# EAGLE design Display (EAGLE 9.3.0)
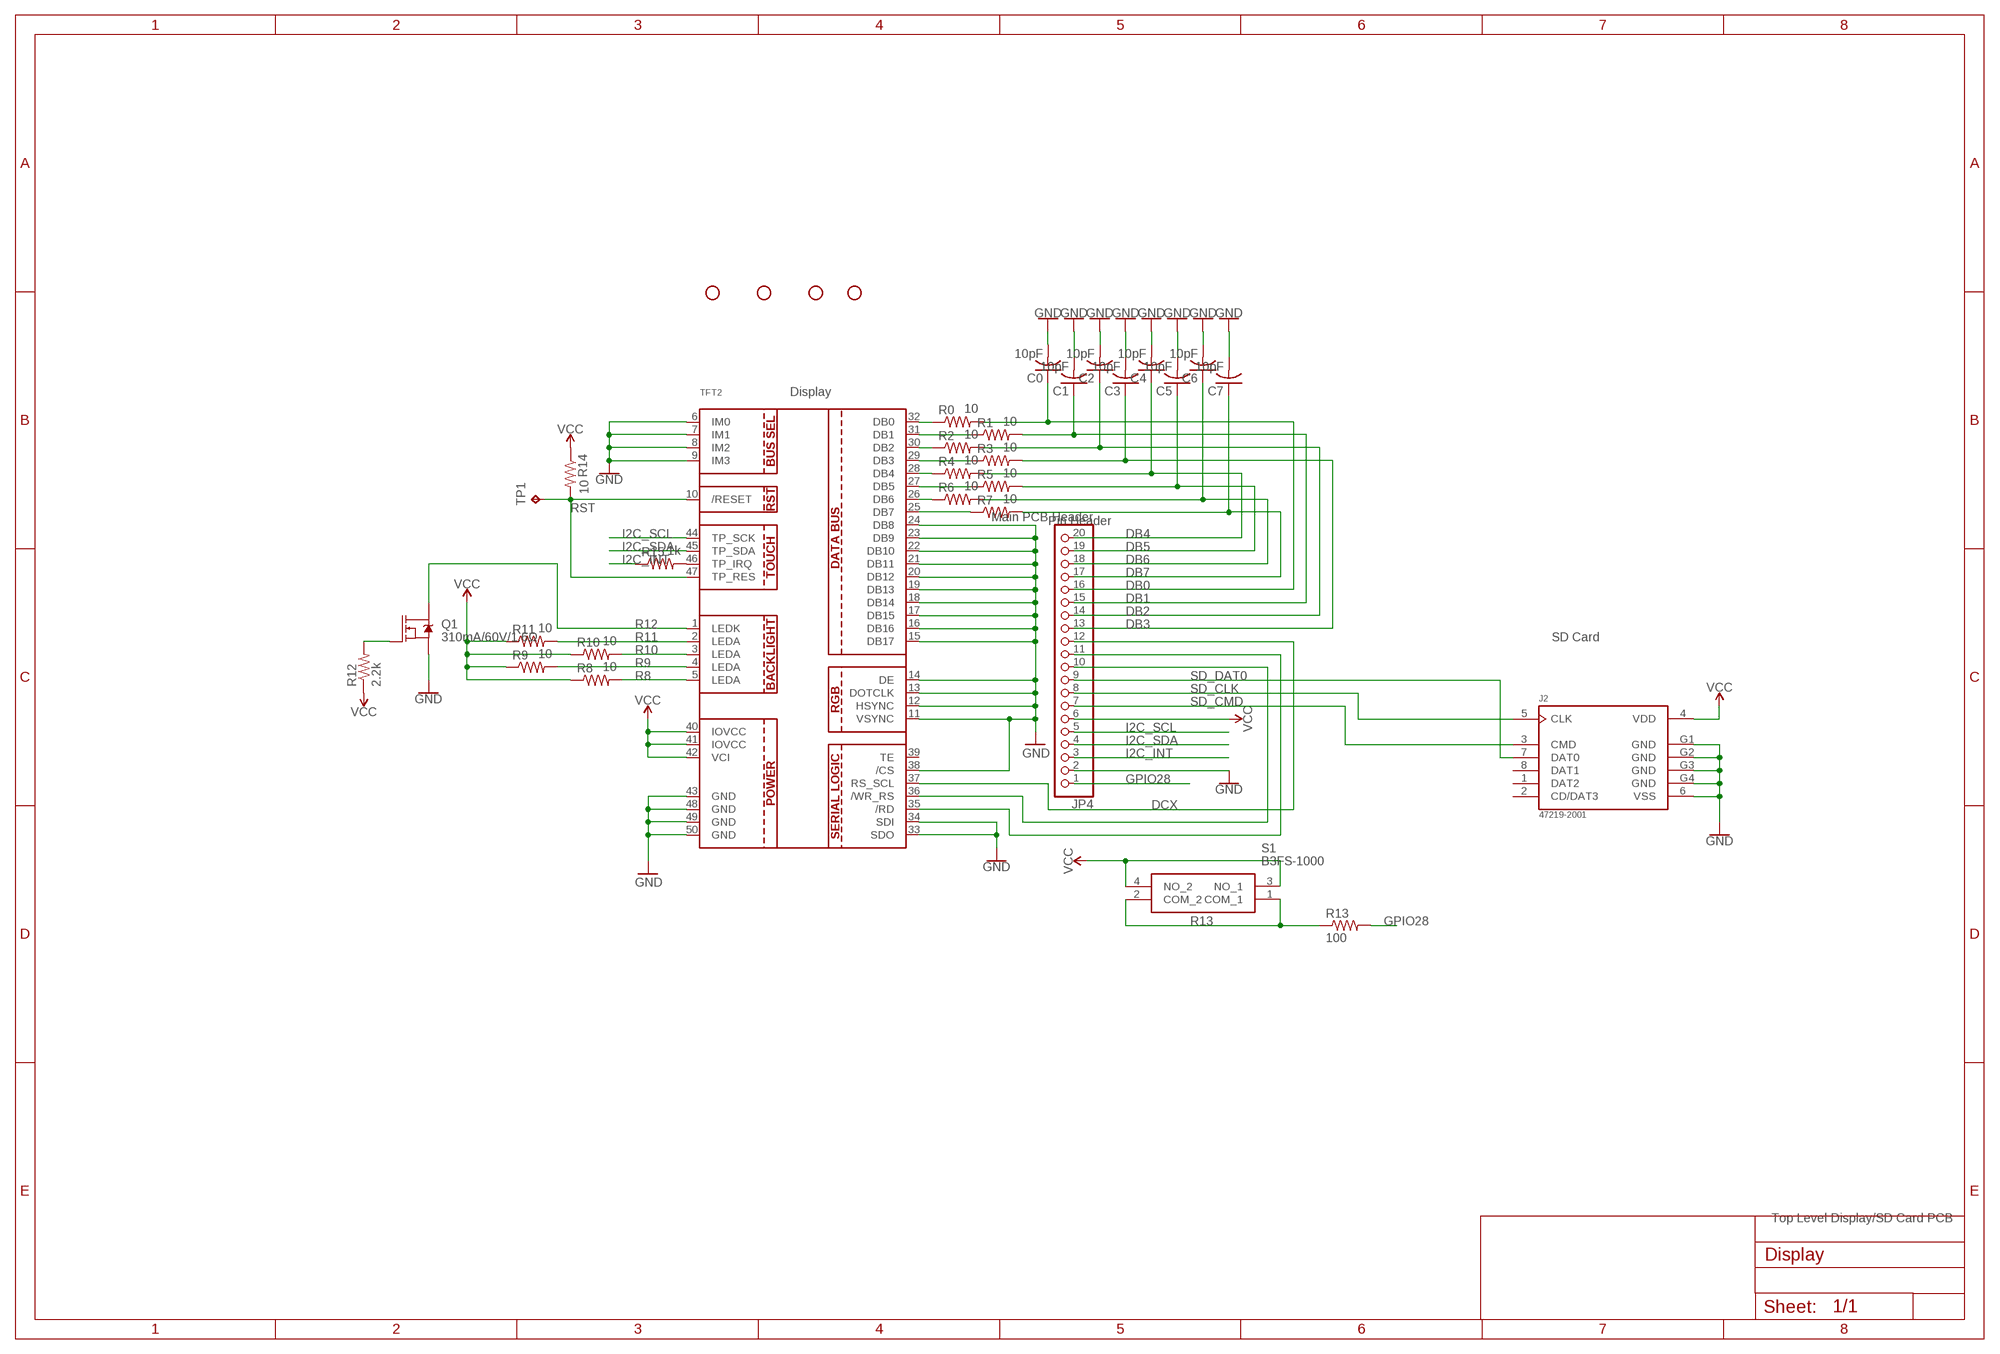
[diagram p0: schematic, sheet 1]

## Parts
C0  10pF  C-USC0805  [C0805]
C1  10pF  C-USC0805  [C0805]
C2  10pF  C-USC0805  [C0805]
C3  10pF  C-USC0805  [C0805]
C4  10pF  C-USC0805  [C0805]
C5  10pF  C-USC0805  [C0805]
C6  10pF  C-USC0805  [C0805]
C7  10pF  C-USC0805  [C0805]
H1  STAND-OFF  [STAND-OFF]
H2  STAND-OFF  [STAND-OFF]
H3  STAND-OFF  [STAND-OFF]
H4  STAND-OFF  [STAND-OFF]
J2  47219-2001  [MOLEX_47219-2001]
JP4  Main PCB Header  PINHD-1X20  [1X20]
Q1  310mA/60V/1.6Ω  MOSFET-NCH-2N7002PW  [SOT323]
R0  10  R-US_R0805  [R0805]
R1  10  R-US_R0805  [R0805]
R2  10  R-US_R0805  [R0805]
R3  10  R-US_R0805  [R0805]
R4  10  R-US_R0805  [R0805]
R5  10  R-US_R0805  [R0805]
R6  10  R-US_R0805  [R0805]
R7  10  R-US_R0805  [R0805]
R8  10  R-US_R0805  [R0805]
R9  10  R-US_R0805  [R0805]
R10  10  R-US_R0805  [R0805]
R11  10  R-US_R0805  [R0805]
R12  2.2k  R-US_M0805  [M0805]
R13  100  R-US_R0805  [R0805]
R14  10  R-US_R0805  [R0805]
R15  1k  R-US_R0805  [R0805]
S1  B3FS-1000  [B3FS1000]
TFT2  DISP_LCD_CTP28_DATASHEET  [TFT_CTP28]
TP1  TPTP09R  [TP09R]

## Nets
DB0: C0.1 JP4.16 R0.2
DB1: C1.1 JP4.15 R1.2
DB2: C2.1 JP4.14 R2.2
DB3: C3.1 JP4.13 R3.2
DB4: C4.1 JP4.20 R4.2
DB5: C5.1 JP4.19 R5.2
DB6: C6.1 JP4.18 R6.2
DB7: C7.1 JP4.17 R7.2
DCX: JP4.12 TFT2.37(RS_SCL)
GND: C0.2 C1.2 C2.2 C3.2 C4.2 C5.2 C6.2 C7.2 J2.6(VSS) J2.G1(GND) J2.G2(GND) J2.G3(GND) J2.G4(GND) JP4.2 Q1.2(S) TFT2.6(IM0) TFT2.7(IM1) TFT2.8(IM2) TFT2.9(IM3) TFT2.11(VSYNC) TFT2.12(HSYNC) TFT2.13(DOTCLK) TFT2.14(DE) TFT2.15(DB17) TFT2.16(DB16) TFT2.17(DB15) TFT2.18(DB14) TFT2.19(DB13) TFT2.20(DB12) TFT2.21(DB11) TFT2.22(DB10) TFT2.23(DB9) TFT2.24(DB8) TFT2.33(SDO) TFT2.34(SDI) TFT2.38(/CS) TFT2.43(GND) TFT2.48(GND) TFT2.49(GND) TFT2.50(GND)
GPIO28: JP4.1 R13.2
I2C_INT: JP4.3 R15.1
I2C_SCL: JP4.5 TFT2.44(TP_SCK)
I2C_SDA: JP4.4 TFT2.45(TP_SDA)
N$1: R0.1 TFT2.32(DB0)
N$2: R1.1 TFT2.31(DB1)
N$3: R2.1 TFT2.30(DB2)
N$4: R15.2 TFT2.46(TP_IRQ)
N$5: R3.1 TFT2.29(DB3)
N$6: R4.1 TFT2.28(DB4)
N$7: R5.1 TFT2.27(DB5)
N$8: R7.1 TFT2.25(DB7)
N$9: R6.1 TFT2.26(DB6)
N$76: Q1.1(G) R12.2
R8: R8.2 TFT2.5(LEDA)
R9: R9.2 TFT2.4(LEDA)
R10: R10.2 TFT2.3(LEDA)
R11: R11.2 TFT2.2(LEDA)
R12: Q1.3(D) TFT2.1(LEDK)
R13: R13.1 S1.1(COM_1) S1.2(COM_2)
RDX: JP4.11 TFT2.35(/RD)
RST: R14.2 TFT2.10(/RESET) TFT2.47(TP_RES) TP1.TP
SD_CLK: J2.5(CLK) JP4.8
SD_CMD: J2.3(CMD) JP4.7
SD_DAT0: J2.7(DAT0) JP4.9
VCC: J2.4(VDD) JP4.6 R8.1 R9.1 R10.1 R11.1 R12.1 R14.1 S1.3(NO_1) S1.4(NO_2) TFT2.40(IOVCC) TFT2.41(IOVCC) TFT2.42(VCI)
WRX: JP4.10 TFT2.36(/WR_RS)
Unconnected: J2.1(DAT2) J2.2(CD/DAT3) J2.8(DAT1) TFT2.39(TE)

## Notes on the sheet
- Display
- Pin Header
- SD Card
- Top Level Display/SD Card PCB

## Library data of the parts
C0 C1-C7 = adafruit:C-US: CAPACITOR, American symbol
H1-H4 = SparkFun-Hardware:STAND-OFF: Stand Off Drill holes for mechanically mounting via screws, standoffs, etc. Note: Use the keepout ring to avoid running the screw head into surrounding components. Variant Overviews STAND-OFF - Mechanical footprint for a #4 phillips button head screw. STAND-OFF-TIGHT - Mechanical footprint for a #4 phillips button head screw, Example SparkFun Products Screw - Phillips Head (1/4", 4-40, 10 pack) <https://www.sparkfun.com/products/10453> (PRT-10453) Screw - Phillips Head (1/2", 4-40, 10 pack) <https://www.sparkfun.com/products/10452> (PRT-10452) Screw - Phillips Head (3/4", 4-40, 10 pack) <https://www.sparkfun.com/products/10451> (PRT-10451) Screw - Phillips Head (1", 4-40, 10 pack) <https://www.sparkfun.com/products/10450> (PRT-10450)
J2 = 47219-2001:47219-2001: 1.10mm Pitch microSD Card Connector, Hinge Type, Lead-Free http://www.snapeda.com/parts/47219-2001/Molex%20/%20Waldom/view-part/#; AVAILABILITY: Unavailable; DESCRIPTION: 8 Position Card Connector Secure Digital - microSD™ Surface Mount, Right Angle Gold; MF: Molex; MP: 47219-2001; PACKAGE: None; PRICE: None
JP4 = adafruit:PINHD-1X20: PIN HEADER
Q1 = SparkFun-DiscreteSemi:MOSFET-NCH: N-channel MOSFETs Voltage controlled devices that allow control of high current outputs. SparkFun Products: SparkFun OpenScale <https://www.sparkfun.com/products/13261> SparkFun Digital Sandbox <https://www.sparkfun.com/products/12651> SparkFun Monster Moto Shield <https://www.sparkfun.com/products/10182> SparkFun MOSFET Power Controller <https://www.sparkfun.com/products/11214>; PROD_ID: TRANS-11151
R0 R1-R11 R13-R15 = adafruit:R-US_: RESISTOR, American symbol
R12 = rcl:R-US_: RESISTOR, American symbol; SPICEPREFIX: R
S1 = B3FS-1000:B3FS-1000: Switch Tactile N.O. SPST Flat Plunger Gull Wing 0.05A 24VDC 0.98N SMD Bag Source: Datasheet <https://omronfs.omron.com/en_US/ecb/products/pdf/en-b3fs.pdf>; ALLIED_NUMBER: 70175890; ALLIED_PRICE-STOCK: https://www.alliedelec.com/omronelectroniccomponents-b3fs-1000/70175890/; DESCRIPTION: Switch Tactile N.O. SPST Flat Plunger Gull Wing 0.05A 24VDC 0.98N SMD Bag; HEIGHT: 3.3mm; MANUFACTURER_NAME: Omron Electronics; MANUFACTURER_PART_NUMBER: B3FS-1000; MOUSER_PART_NUMBER: 653-B3FS-1000; MOUSER_PRICE-STOCK: https://www.mouser.com/Search/Refine.aspx?Keyword=653-B3FS-1000
TFT2 = adafruit:DISP_LCD_CTP28: 2.83" 240x320 Pixel Capacitive Touch Display
TP1 = testpad:TP: Test pad

## Board
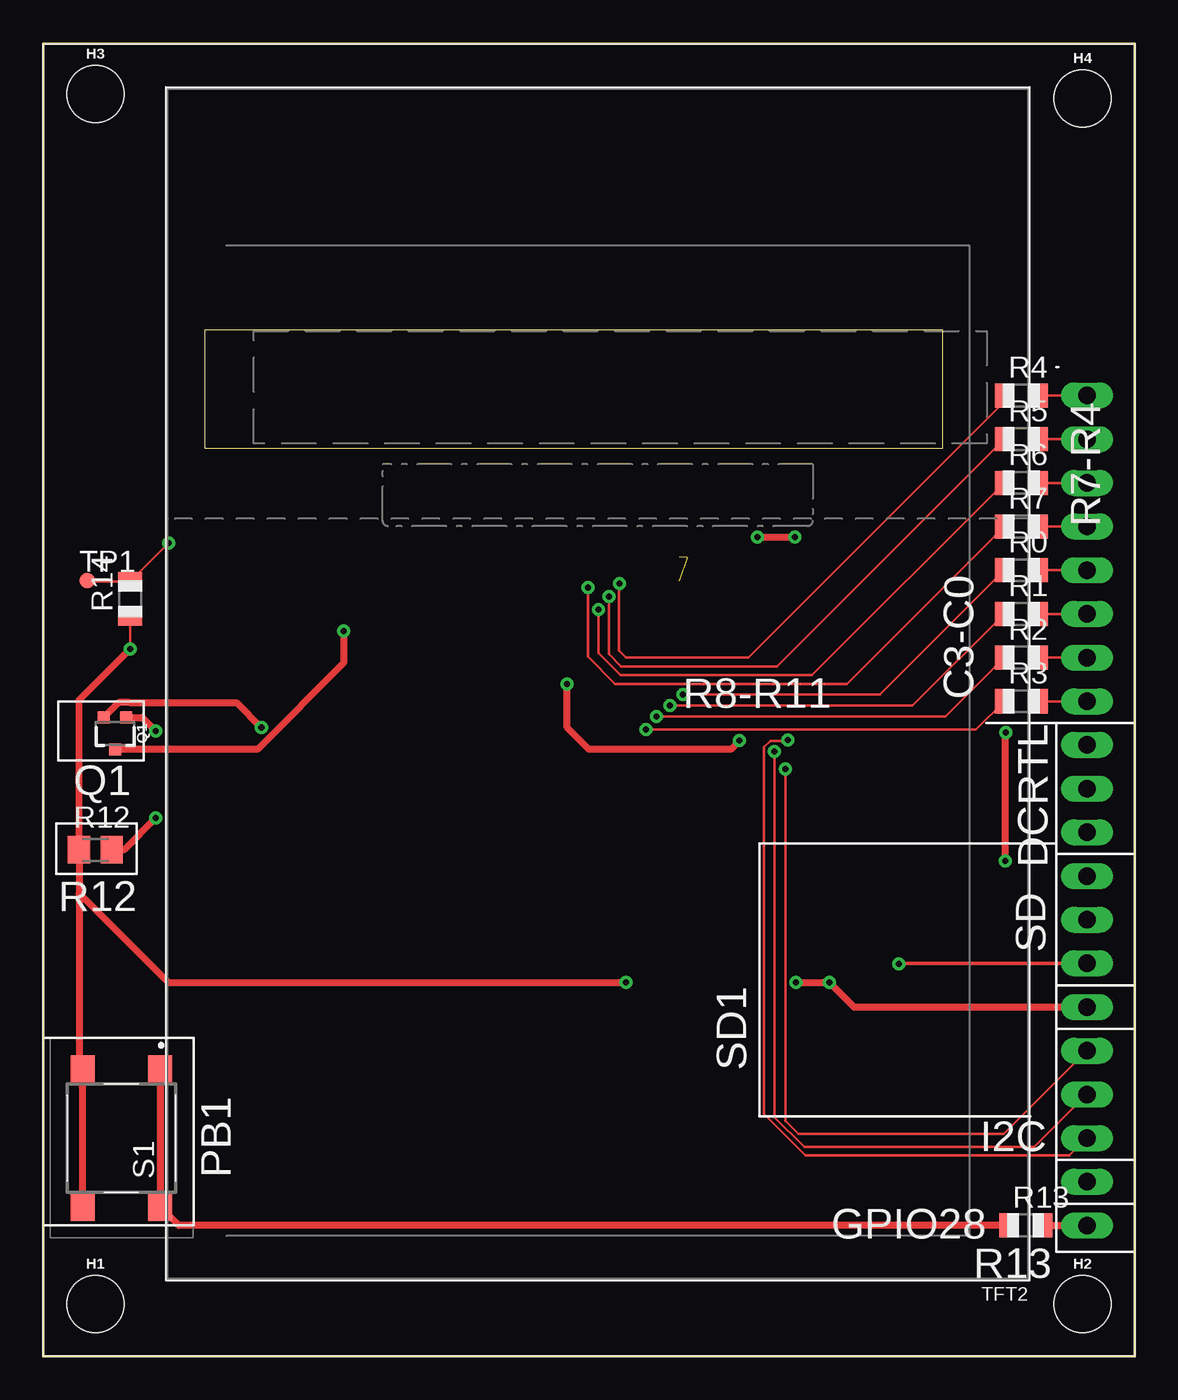
[diagram p1: board, top side]
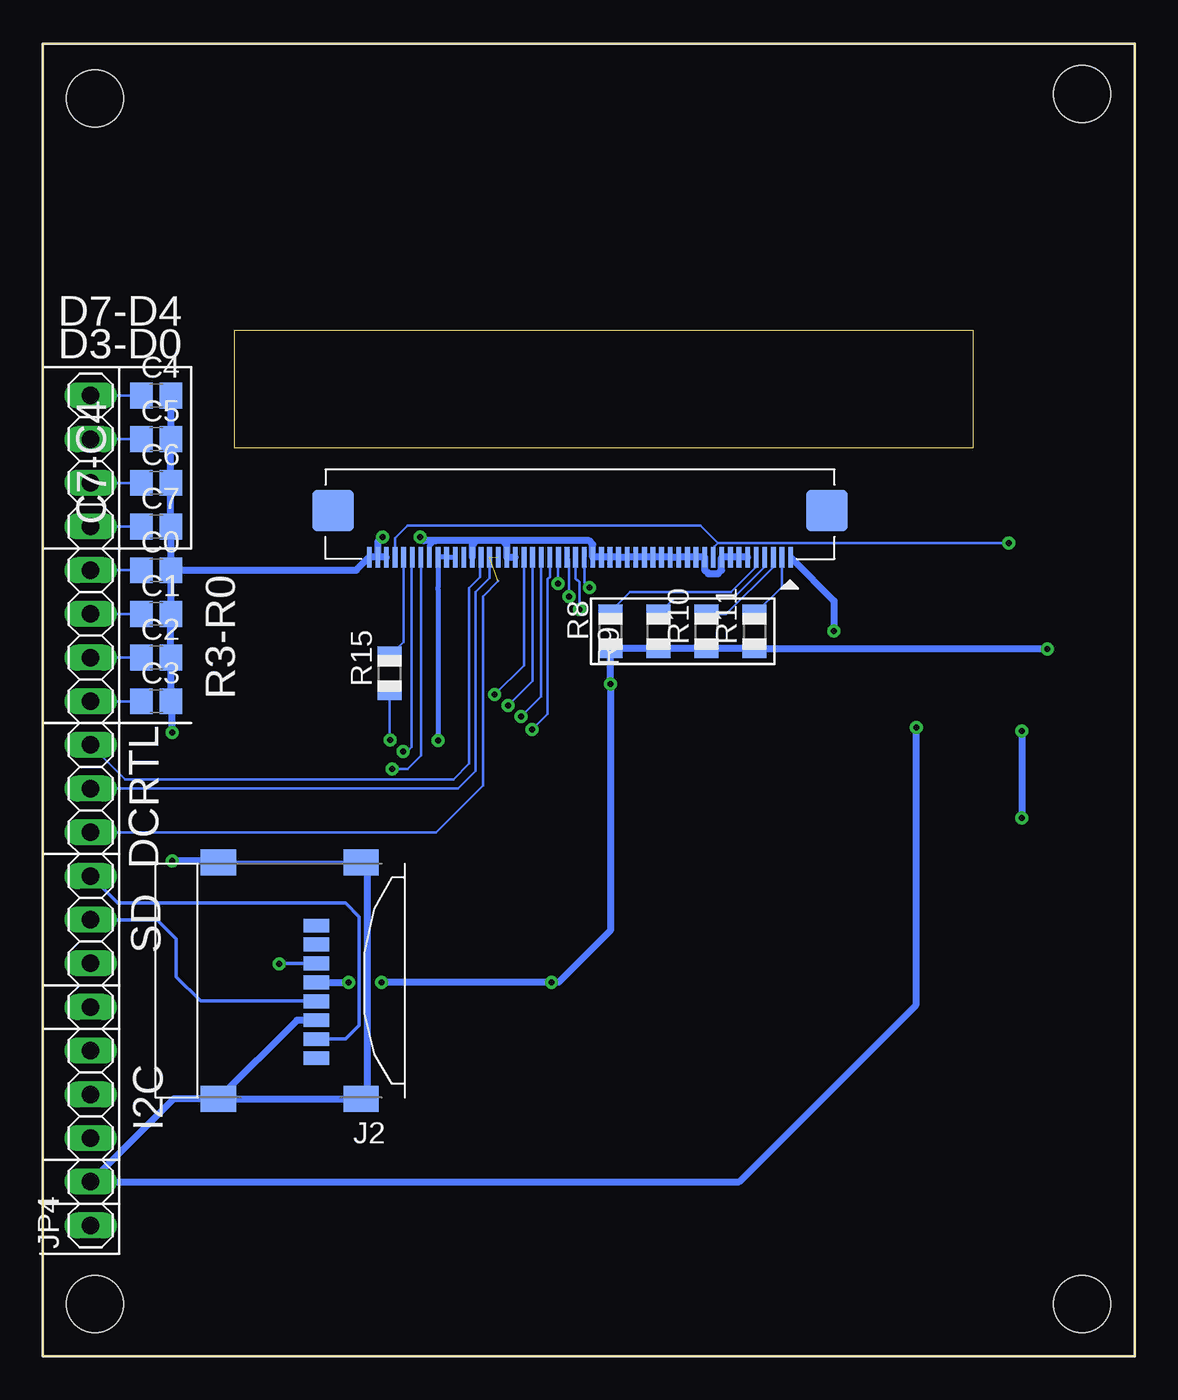
[diagram p2: board, bottom side, seen from below]

Size 63.48 x 76.38 mm. Coordinates in mm from the lower left corner, seen from the top.
Outline: 0,0 63.48,0 63.48,76.38 0,76.38 0,0
Copper layers (1*16): Top 0.035mm / dielectric 1.5mm / Bottom 0.035mm
Design rules "default *": minimum track width 6mil, minimum drill 0.35mm, track to track 6mil, track to pad 6mil, pad to pad 6mil, via to via 6mil, smd to smd 6mil, copper to edge 40mil, drill to drill 6mil, minimum pad ring 10mil, minimum via ring 8mil, stop-mask expansion 4mil, vias tented up to drill 14mil, thermal gap 10mil
Milling: area 9.4,52.8 to 52.3,59.7

### Footprints (pad centres in the part's own frame; a part is rotated, then mirrored left to right if it is on the bottom)
C0805 = smd 1.3 x 1.5: 1 -0.85,0; 2 0.85,0
STAND-OFF = hole 3.302: 0,0
MOLEX_47219-2001 = smd 0.8 x 1.5: 1 3.2,-2.1; 2 2.1,-2.1; 3 1,-2.1; 4 -0.1,-2.1; 5 -1.2,-2.1; 6 -2.3,-2.1; 7 -3.4,-2.1; 8 -4.5,-2.1 | smd 1.5 x 2.05: G1 6.875,-4.7; G2 6.875,3.6; G3 -6.875,3.6; G4 -6.875,-4.7
1X20 = drill 1.016 long: 1 -24.13,0; 2 -21.59,0; 3 -19.05,0; 4 -16.51,0; 5 -13.97,0; 6 -11.43,0; 7 -8.89,0; 8 -6.35,0; 9 -3.81,0; 10 -1.27,0; 11 1.27,0; 12 3.81,0; 13 6.35,0; 14 8.89,0; 15 11.43,0; 16 13.97,0; 17 16.51,0; 18 19.05,0; 19 21.59,0; 20 24.13,0
SOT323 = smd 0.7 x 0.7: 1 -0.65,-0.925; 2 0.65,-0.925; 3 0,0.925
R0805 = smd 1.1 x 1.4: 1 -1,0; 2 1,0
M0805 = smd 1.3 x 1.6: 1 -0.95,0; 2 0.95,0
B3FS1000 = smd 1.6 x 1.4: 1 4,-2.25; 2 -4,-2.25; 3 4,2.25; 4 -4,2.25
TFT_CTP28 = smd 0.275 x 1.2 bottom: 1 12.25,-7.36; 2 11.75,-7.36; 3 11.25,-7.36; 4 10.75,-7.36; 5 10.25,-7.36; 6 9.75,-7.36; 7 9.25,-7.36; 8 8.75,-7.36; 9 8.25,-7.36; 10 7.75,-7.36; 11 7.25,-7.36; 12 6.75,-7.36; 13 6.25,-7.36; 14 5.75,-7.36; 15 5.25,-7.36; 16 4.75,-7.36; 17 4.25,-7.36; 18 3.75,-7.36; 19 3.25,-7.36; 20 2.75,-7.36; 21 2.25,-7.36; 22 1.75,-7.36; 23 1.25,-7.36; 24 0.75,-7.36; 25 0.25,-7.36; 26 -0.25,-7.36; 27 -0.75,-7.36; 28 -1.25,-7.36; 29 -1.75,-7.36; 30 -2.25,-7.36; 31 -2.75,-7.36; 32 -3.25,-7.36; 33 -3.75,-7.36; 34 -4.25,-7.36; 35 -4.75,-7.36; 36 -5.25,-7.36; 37 -5.75,-7.36; 38 -6.25,-7.36; 39 -6.75,-7.36; 40 -7.25,-7.36; 41 -7.75,-7.36; 42 -8.25,-7.36; 43 -8.75,-7.36; 44 -9.25,-7.36; 45 -9.75,-7.36; 46 -10.25,-7.36; 47 -10.75,-7.36; 48 -11.25,-7.36; 49 -11.75,-7.36; 50 -12.25,-7.36 | smd 2.4 x 2.4 bottom: PAD1 14.35,-10.06; PAD2 -14.35,-10.06
TP09R = smd 0.9 x 0.9: TP 0,0

### Placement (x,y rotation side)
C0  56.9,45.72 0 bottom
C1  56.9,43.18 0 bottom
C2  56.9,40.64 0 bottom
C3  56.9,38.1 0 bottom
C4  56.9,55.88 0 bottom
C5  56.9,53.34 0 bottom
C6  56.9,50.8 0 bottom
C7  56.9,48.26 0 bottom
H1  3.05,3.05 0 top
H2  60.45,3.05 0 top
H3  3.05,73.41 0 top
H4  60.45,73.15 0 top
J2  49.68,21.86 90 bottom
JP4  60.71,31.75 90 bottom
Q1  4.19,36.23 180 top
R0  56.9,45.72 0 top
R1  56.9,43.18 0 top
R2  56.9,40.64 0 top
R3  56.9,38.1 0 top
R4  56.9,55.88 0 top
R5  56.9,53.34 0 top
R6  56.9,50.8 0 top
R7  56.9,48.26 0 top
R8  30.48,42.16 90 bottom
R9  27.69,42.16 90 bottom
R10  24.89,42.16 90 bottom
R11  22.1,42.16 90 bottom
R12  3.05,29.46 0 top
R13  57.15,7.62 0 top
R14  5.08,44.07 90 top
R15  43.32,39.73 90 bottom
S1  4.57,12.7 90 top
TFT2  32.26,39.12 180 top
TP1  2.57,45.11 0 top

### Tracks (layer width: path | path; a pad name or v marks a point on that pad's centre or on a via)
DB0
  Top 0.152: R0.2 JP4.16
  Bottom 0.152: C0.1 JP4.16
DB1
  Top 0.152: R1.2 JP4.15
  Bottom 0.152: C1.1 JP4.15
DB2
  Top 0.152: R2.2 JP4.14
  Bottom 0.152: C2.1 JP4.14
DB3
  Top 0.152: R3.2 JP4.13
  Bottom 0.152: C3.1 JP4.13
DB4
  Top 0.152: R4.2 JP4.20
  Bottom 0.152: C4.1 JP4.20
DB5
  Top 0.152: R5.2 JP4.19
  Bottom 0.152: C5.1 JP4.19
DB6
  Top 0.152: R6.2 JP4.18
  Bottom 0.152: C6.1 JP4.18
DB7
  Top 0.152: R7.2 JP4.17
  Bottom 0.152: C7.1 JP4.17
DCX
  Bottom 0.152: JP4.12 58.7,33.55 39.61,33.55 38.69,34.47 38.69,44.7 38.07,45.32 38.07,46.41 TFT2.37
GND  (via drill 0.35)
  Top 0.406: Q1.2 4.4,38.02 5.05,38.02 11.26,38.02 v12.7,36.58 | v41.54,47.65 v43.74,47.65 | v55.96,28.8 55.96,36.27 v55.98,36.29
  Bottom 0.152: TFT2.24 31.45,46.48
  Bottom 0.203: J2.G2 J2.G1
  Bottom 0.305: 40.64,47.43 40.69,47.38 40.77,47.38 41.01,47.15 TFT2.43
  Bottom 0.406: TFT2.6 TFT2.7 TFT2.8 TFT2.9 24.02,45.73 24.22,45.52 24.79,45.52 25,45.73 TFT2.11 TFT2.12 TFT2.13 TFT2.14 TFT2.15 TFT2.16 TFT2.17 TFT2.18 | v55.98,36.29 55.98,38.03 C3.2 C2.2 C1.2 C0.2 | C0.2 C7.2 C6.2 C5.2 C4.2 | 38.29,47.43 38.5,47.22 TFT2.38 | 36.72,47.43 36.52,47.22 TFT2.34 TFT2.33 | 36.72,47.43 38.29,47.43 | 38.29,47.43 40.64,47.43 41.32,47.43 v41.54,47.65 | TFT2.49 TFT2.50 45.26,45.72 C0.2 | v12.7,36.58 12.7,20.45 22.99,10.16 JP4.2 55.88,14.99 J2.G3 | TFT2.24 31.52,47.22 31.72,47.43 36.72,47.43 | TFT2.48 TFT2.49 | v43.74,47.65 44.01,47.38 TFT2.49 | TFT2.18 TFT2.19 | TFT2.18 TFT2.20 TFT2.21 TFT2.22 TFT2.23 TFT2.24 | J2.G3 J2.G4 44.63,15.34 44.63,28.38 J2.G1 | J2.6 48.72,19.56 J2.G3 | J2.G2 53.35,28.8 v55.96,28.8
GPIO28
  Top 0.406: R13.2 JP4.1
I2C_INT  (via drill 0.35)
  Top 0.152: JP4.3 59.69,11.68 44.35,11.68 41.91,14.12 41.91,34.16 41.94,34.19 41.94,35.43 42.29,35.79 43.25,35.79 v43.31,35.84
  Bottom 0.152: R15.1 43.32,35.85 v43.31,35.84
I2C_SCL  (via drill 0.35)
  Top 0.152: JP4.5 55.88,12.95 43.94,12.95 43.18,13.72 v43.18,34.16
  Bottom 0.152: TFT2.44 41.51,46.35 41.5,46.34 41.5,34.95 42.29,34.16 v43.18,34.16
I2C_SDA  (via drill 0.35)
  Top 0.152: JP4.4 57.66,12.19 44.27,12.19 42.55,13.92 v42.55,35.18
  Bottom 0.152: v42.55,35.18 42.29,35.18 42.04,35.43 42.04,46.45 TFT2.45
N$1  (via drill 0.35)
  Top 0.152: v37.21,38.48 48.66,38.48 R0.1
  Bottom 0.152: v37.21,38.48 35.51,40.18 TFT2.32
N$2  (via drill 0.35)
  Top 0.152: R1.1 50.56,37.85 v36.45,37.85
  Bottom 0.152: v36.45,37.85 35.01,39.29 TFT2.31
N$3  (via drill 0.35)
  Top 0.152: R2.1 52.47,37.21 v35.69,37.21
  Bottom 0.152: v35.69,37.21 34.51,38.39 TFT2.30
N$4
  Bottom 0.152: TFT2.46 42.51,41.54 R15.2
N$5  (via drill 0.35)
  Top 0.152: v35.05,36.45 54.24,36.45 R3.1
  Bottom 0.152: TFT2.29 34.01,45.34 34.13,45.21 34.13,37.37 v35.05,36.45
N$6  (via drill 0.35)
  Top 0.152: v33.53,44.96 33.51,44.94 33.51,41.04 33.91,40.64 41.02,40.64 55.9,55.52 R4.1
  Bottom 0.152: v33.53,44.96 33.53,46.46 TFT2.28
N$7  (via drill 0.35)
  Top 0.152: R5.1 42.69,40.13 33.62,40.13 32.9,40.85 v32.9,44.2
  Bottom 0.152: v32.9,44.2 32.9,46.37 TFT2.27
N$8  (via drill 0.35)
  Top 0.152: v31.69,44.7 31.69,40.7 33.27,39.12 46.75,39.12 R7.1
  Bottom 0.152: v31.69,44.7 31.99,45.01 31.99,45.83 32.01,45.85 TFT2.25
N$9  (via drill 0.35)
  Top 0.152: R6.1 44.72,39.62 33.57,39.62 32.29,40.9 v32.29,43.43
  Bottom 0.152: v32.29,43.43 32.29,45.03 32.5,45.23 TFT2.26
N$76  (via drill 0.35)
  Top 0.406: Q1.1 5.78,37.16 v6.57,36.37 | v6.55,31.3 4.71,29.46 R12.2
  Bottom 0.406: v6.57,36.37 6.57,31.32 v6.55,31.3
R8
  Bottom 0.152: TFT2.5 22.02,45.91 23.47,44.45 29.34,44.45 30.48,43.31 R8.2
R9
  Bottom 0.152: R9.2 26.78,44.07 23.35,44.07 21.52,45.91 TFT2.4
R10
  Bottom 0.152: TFT2.3 21.02,45.91 23.76,43.16 R10.2
R11
  Bottom 0.152: R11.2 20.51,44.75 TFT2.2
R12  (via drill 0.35)
  Top 0.406: v17.48,42.18 v17.47,42.17 17.47,40.31 12.47,35.31 Q1.3
  Bottom 0.152: TFT2.1 19.94,46.41
  Bottom 0.406: 19.94,46.41 17.48,43.94 v17.48,42.18
R13
  Top 0.406: R13.1 7.9,7.62 S1.2 S1.1
RDX  (1 unrouted)
  Bottom 0.152: JP4.11 39.35,33.02 38.34,34.04 38.34,44.45 37.52,45.27 37.52,46.47
RST  (via drill 0.35)
  Top 0.152: TP1.TP 2.61,45.07 R14.2 v7.3,47.29 v7.3,47.3
  Bottom 0.152: TFT2.10 24.45,46.54 24.45,47.1 24.24,47.3 | TFT2.47 43.01,47.58 42.27,48.32 25.26,48.32 24.24,47.3 | 24.24,47.3 7.31,47.3 v7.3,47.3
SD_CLK
  Bottom 0.203: JP4.8 56.85,25.4 55.73,24.28 55.73,22.09 54.31,20.67 47.6,20.67 J2.5
SD_CMD  (via drill 0.35)
  Top 0.203: JP4.7 49.78,22.86 v49.76,22.84
  Bottom 0.203: v49.76,22.84 49.74,22.86 J2.3
SD_DAT0
  Bottom 0.203: JP4.9 59.13,26.36 45.88,26.36 45.09,25.57 45.09,19.25 45.88,18.46 J2.7
VCC  (via drill 0.35)
  Top 0.152: R14.1 v5.08,41.15
  Top 0.203: R12.1 2.1,26.92 2.1,26.67
  Top 0.406: v40.51,35.81 40.01,35.31 31.75,35.31 30.48,36.58 v30.48,39.12 | 2.1,26.92 7.27,21.75 v33.9,21.75 | S1.4 S1.3 2.1,16.92 2.1,26.67 R12.1 2.1,38.17 v5.08,41.15 | v43.79,21.75 v45.72,21.75 v45.72,21.76 47.16,20.32 JP4.6
  Bottom 0.152: TFT2.42 40.49,46.48
  Bottom 0.203: 22.23,41.16 R10.1 25.27,41.16 R9.1
  Bottom 0.305: v40.51,35.81 40.51,44.62 40.49,44.83 40.49,46.48 | TFT2.40 TFT2.41 TFT2.42
  Bottom 0.406: 25.27,41.16 22.23,41.16 R11.1 22.08,41.15 v5.08,41.15 | R10.1 R9.1 R8.1 v30.48,39.12 30.48,24.77 33.49,21.75 v33.9,21.75 v43.79,21.75 | J2.4 v45.72,21.76
WRX  (1 unrouted)
  Bottom 0.152: JP4.10 40.63,30.48 37.9,33.21 37.9,44.18 37.01,45.08

### Text on the board
tPlace: R7-R4 | R8-R11 | C3-C0 | Q1 | DCRTL | R12 | SD | SD1 | PB1 | I2C | GPIO28 | R13
bPlace: D7-D4 | D3-D0 | C7-C4 | R3-R0 | DCRTL | SD | I2C